# EAGLE design audio_electrode (EAGLE 5.06)
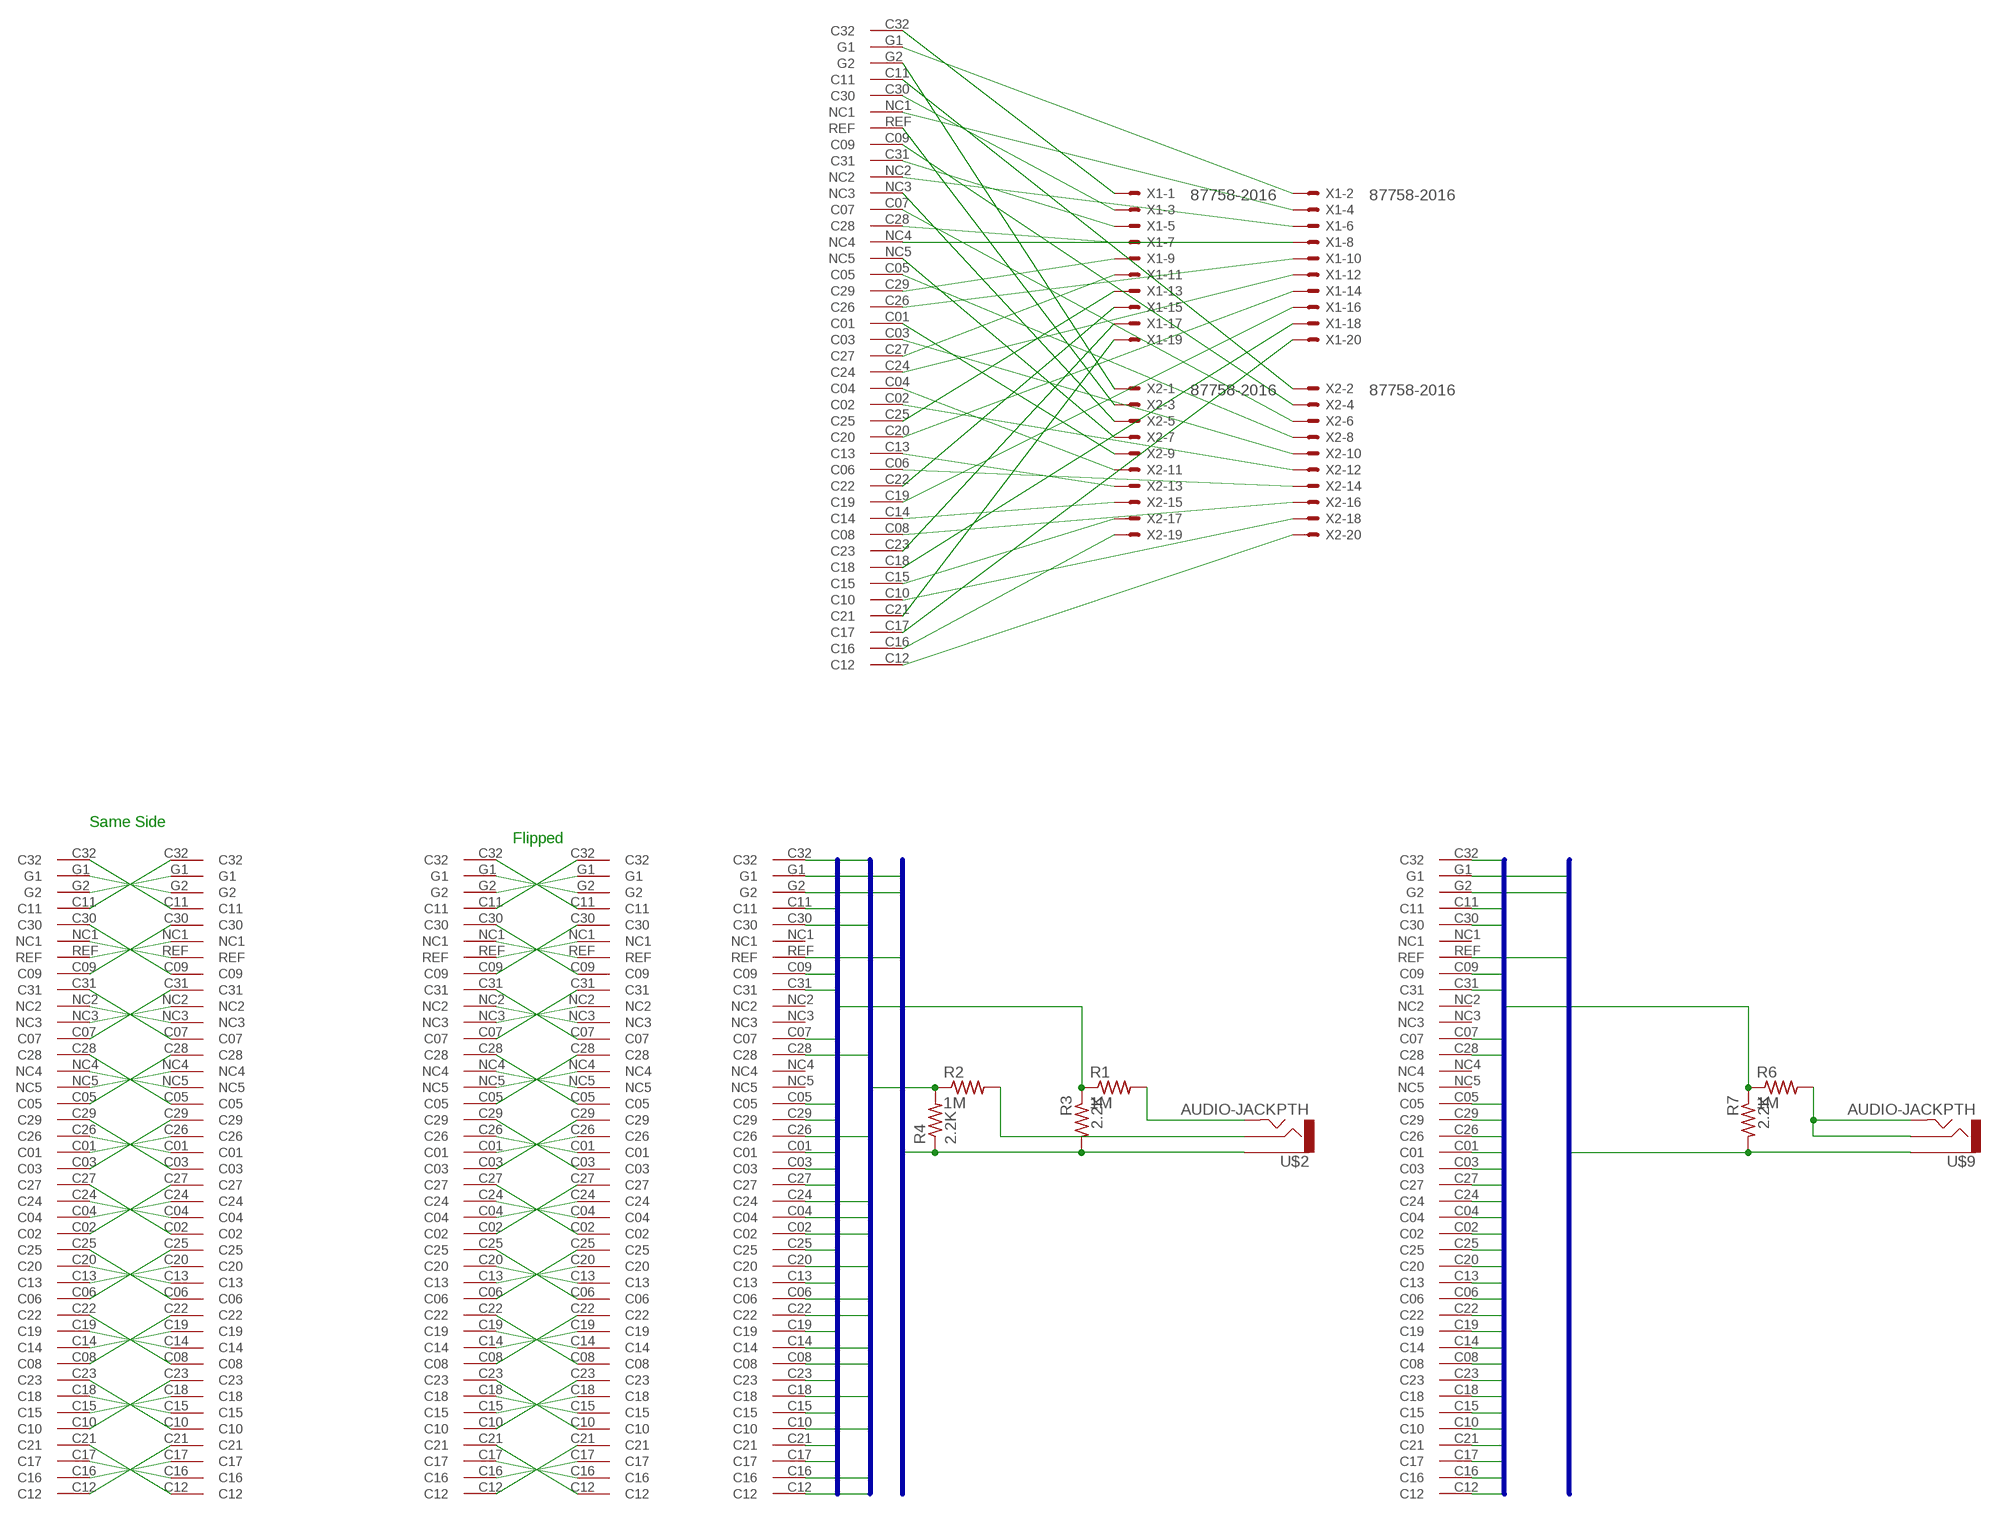
[diagram p0: schematic, sheet 1]

## Parts
R1  1M  R-US_M1206  [M1206]
R2  1M  R-US_M1206  [M1206]
R3  2.2K  R-US_0207/2V  [0207/2V]
R4  2.2K  R-US_0207/2V  [0207/2V]
R6  1M  R-US_0207/2V  [0207/2V]
R7  2.2K  R-US_0207/2V  [0207/2V]
U$1  MOLC-110-01-S-QNEURO-NEXUS  [MOLC-110-01-S-Q]
U$2  AUDIO-JACKPTH  [AUDIO-JACK]
U$3  MOLC-110-01-S-QNEURO-NEXUS  [MOLC-110-01-S-Q]
U$4  MOLC-110-01-S-QNEURO-NEXUS  [MOLC-110-01-S-Q]
U$5  MOLC-110-01-S-QNEURO-NEXUS  [MOLC-110-01-S-Q]
U$6  MOLC-110-01-S-QNEURO-NEXUS  [MOLC-110-01-S-Q]
U$7  MOLC-110-01-S-QNEURO-NEXUS  [MOLC-110-01-S-Q]
U$8  MOLC-110-01-S-QNEURO-NEXUS  [MOLC-110-01-S-Q]
U$9  AUDIO-JACKPTH  [AUDIO-JACK]
X1  87758-2016  [87758-2016]
X2  87758-2016  [87758-2016]

## Nets
BEVEN: R2.1 R4.2 U$1.C02 U$1.C04 U$1.C06 U$1.C08 U$1.C10 U$1.C12 U$1.C14 U$1.C16 U$1.C18 U$1.C20 U$1.C22 U$1.C24 U$1.C26 U$1.C28 U$1.C30 U$1.C32
BGND: R3.2 R4.1 U$1.G1 U$1.G2 U$1.REF U$2.1
BGND2: R7.2 U$8.G1 U$8.G2 U$8.REF U$9.1
BODD: R1.1 R3.1 U$1.C01 U$1.C03 U$1.C05 U$1.C07 U$1.C09 U$1.C11 U$1.C13 U$1.C15 U$1.C17 U$1.C19 U$1.C21 U$1.C23 U$1.C25 U$1.C27 U$1.C29 U$1.C31
BSIG: R6.1 R7.1 U$8.C01 U$8.C02 U$8.C03 U$8.C04 U$8.C05 U$8.C06 U$8.C07 U$8.C08 U$8.C09 U$8.C10 U$8.C11 U$8.C12 U$8.C13 U$8.C14 U$8.C15 U$8.C16 U$8.C17 U$8.C18 U$8.C19 U$8.C20 U$8.C21 U$8.C22 U$8.C23 U$8.C24 U$8.C25 U$8.C26 U$8.C27 U$8.C28 U$8.C29 U$8.C30 U$8.C31 U$8.C32
N$1: R1.2 U$2.5
N$2: R2.2 U$2.2
N$3: U$3.C32 U$4.C11
N$4: U$3.C11 U$4.C32
N$5: U$3.G1 U$4.G2
N$6: U$3.G2 U$4.G1
N$7: U$3.C30 U$4.C09
N$8: U$3.C09 U$4.C30
N$9: U$3.REF U$4.NC1
N$10: U$3.NC1 U$4.REF
N$11: U$3.C07 U$4.C31
N$12: U$3.C31 U$4.C07
N$13: U$3.NC3 U$4.NC2
N$14: U$3.NC2 U$4.NC3
N$15: U$3.C28 U$4.C05
N$16: U$3.C05 U$4.C28
N$17: U$3.NC5 U$4.NC4
N$18: U$3.NC4 U$4.NC5
N$19: U$3.C29 U$4.C03
N$20: U$3.C03 U$4.C29
N$21: U$3.C26 U$4.C01
N$22: U$3.C01 U$4.C26
N$23: U$3.C27 U$4.C02
N$24: U$3.C02 U$4.C27
N$25: U$3.C24 U$4.C04
N$26: U$3.C04 U$4.C24
N$27: U$3.C25 U$4.C06
N$28: U$3.C06 U$4.C25
N$29: U$3.C20 U$4.C13
N$30: U$3.C13 U$4.C20
N$31: U$3.C22 U$4.C08
N$32: U$3.C08 U$4.C22
N$33: U$3.C19 U$4.C14
N$34: U$3.C14 U$4.C19
N$35: U$3.C23 U$4.C10
N$36: U$3.C10 U$4.C23
N$37: U$3.C18 U$4.C15
N$38: U$3.C15 U$4.C18
N$39: U$3.C21 U$4.C12
N$40: U$3.C12 U$4.C21
N$41: U$3.C17 U$4.C16
N$42: U$3.C16 U$4.C17
N$43: U$7.C32 X1.1
N$44: U$5.C32 U$6.C11
N$45: U$5.C11 U$6.C32
N$46: U$7.G1 X1.2
N$47: U$5.G1 U$6.G2
N$48: U$5.G2 U$6.G1
N$49: U$5.C30 U$6.C09
N$50: U$5.C09 U$6.C30
N$51: U$5.REF U$6.NC1
N$52: U$5.NC1 U$6.REF
N$53: U$5.C07 U$6.C31
N$54: U$5.C31 U$6.C07
N$55: U$5.NC3 U$6.NC2
N$56: U$5.NC2 U$6.NC3
N$57: U$5.C28 U$6.C05
N$58: U$5.C05 U$6.C28
N$59: U$5.NC5 U$6.NC4
N$60: U$5.NC4 U$6.NC5
N$61: U$5.C29 U$6.C03
N$62: U$5.C03 U$6.C29
N$63: U$5.C26 U$6.C01
N$64: U$5.C01 U$6.C26
N$65: U$5.C27 U$6.C02
N$66: U$5.C02 U$6.C27
N$67: U$5.C24 U$6.C04
N$68: U$5.C04 U$6.C24
N$69: U$5.C25 U$6.C06
N$70: U$5.C06 U$6.C25
N$71: U$5.C20 U$6.C13
N$72: U$5.C13 U$6.C20
N$73: U$5.C22 U$6.C08
N$74: U$5.C08 U$6.C22
N$75: U$5.C19 U$6.C14
N$76: U$5.C14 U$6.C19
N$77: U$5.C23 U$6.C10
N$78: U$5.C10 U$6.C23
N$79: U$5.C18 U$6.C15
N$80: U$5.C15 U$6.C18
N$81: U$5.C21 U$6.C12
N$82: U$5.C12 U$6.C21
N$83: U$5.C17 U$6.C16
N$84: U$5.C16 U$6.C17
N$85: U$7.G2 X2.1
N$86: U$7.C11 X2.2
N$87: U$7.C30 X1.3
N$88: U$7.NC1 X1.4
N$89: U$7.REF X2.3
N$90: U$7.C09 X2.4
N$91: U$7.C31 X1.5
N$92: U$7.NC2 X1.6
N$93: U$7.NC3 X2.5
N$94: U$7.C07 X2.6
N$95: U$7.C28 X1.7
N$96: U$7.NC4 X1.8
N$97: U$7.NC5 X2.7
N$98: U$7.C05 X2.8
N$99: U$7.C29 X1.9
N$100: U$7.C26 X1.10
N$101: U$7.C01 X2.9
N$102: U$7.C03 X2.10
N$103: U$7.C27 X1.11
N$104: U$7.C24 X1.12
N$105: U$7.C04 X2.11
N$106: U$7.C02 X2.12
N$107: U$7.C25 X1.13
N$108: U$7.C20 X1.14
N$109: U$7.C13 X2.13
N$110: U$7.C06 X2.14
N$111: U$7.C22 X1.15
N$112: U$7.C19 X1.16
N$113: U$7.C14 X2.15
N$114: U$7.C08 X2.16
N$115: U$7.C23 X1.17
N$116: U$7.C18 X1.18
N$117: U$7.C15 X2.17
N$118: U$7.C10 X2.18
N$119: U$7.C21 X1.19
N$120: U$7.C17 X1.20
N$121: U$7.C16 X2.19
N$122: U$7.C12 X2.20
N$127: R6.2 U$9.2 U$9.5
Unconnected: U$1.NC1 U$1.NC2 U$1.NC3 U$1.NC4 U$1.NC5 U$8.NC1 U$8.NC2 U$8.NC3 U$8.NC4 U$8.NC5

## Buses
BODD
BEVEN
BGND
BSIG
BGND2

## Notes on the sheet
- Same Side
- Flipped

## Library data of the parts
R1-R4 R6 R7 = resistor:R-US_: RESISTOR, American symbol
U$1 U$3-U$8 = coxlab:MOLC-110-01-S-Q
U$2 U$9 = SparkFun:AUDIO-JACK: 3.5mm Audio Jack Simple 3.5mm common PCB mount audio jack. SKU: PRT-08032
X1 X2 = con-molex:87758-2016: 20 Pin - 2mm Dual Row Single Wafer, Vertical T/H HDR Source: http://www.molex.com/pdm_docs/sd/877580616_sd.pdf

## Board
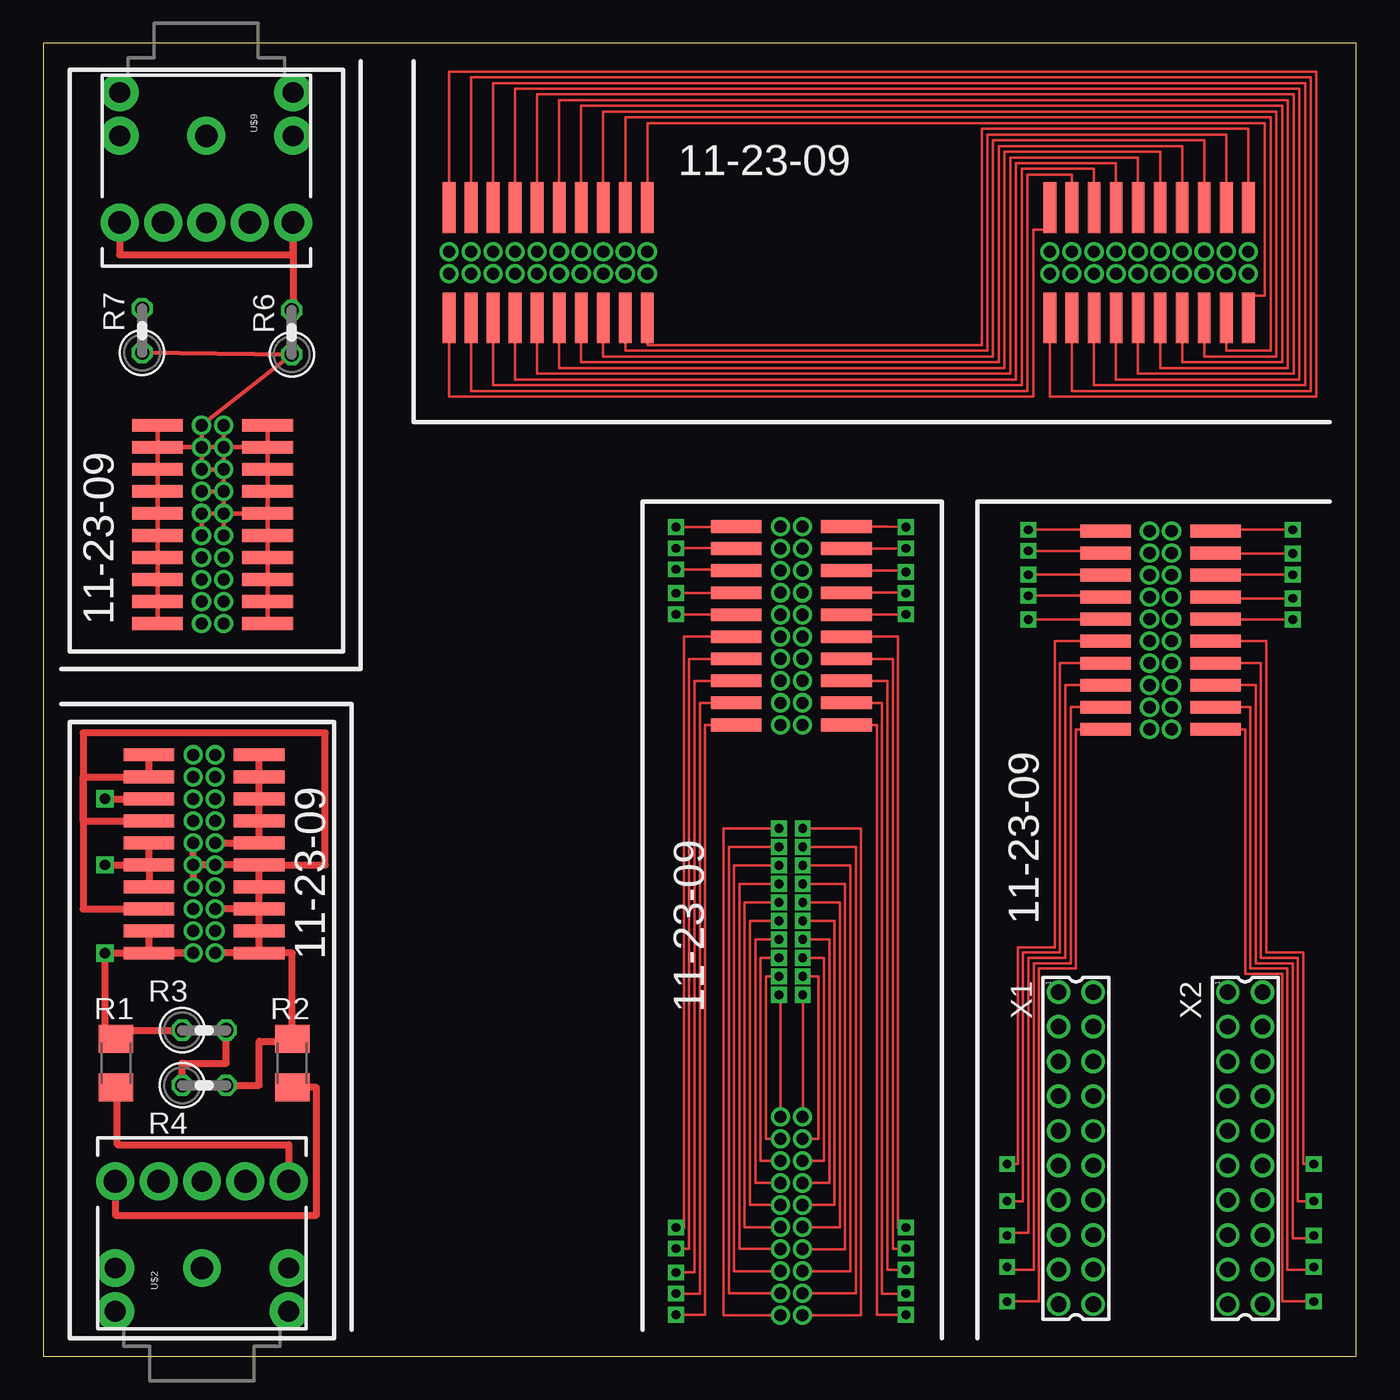
[diagram p1: board, top side]
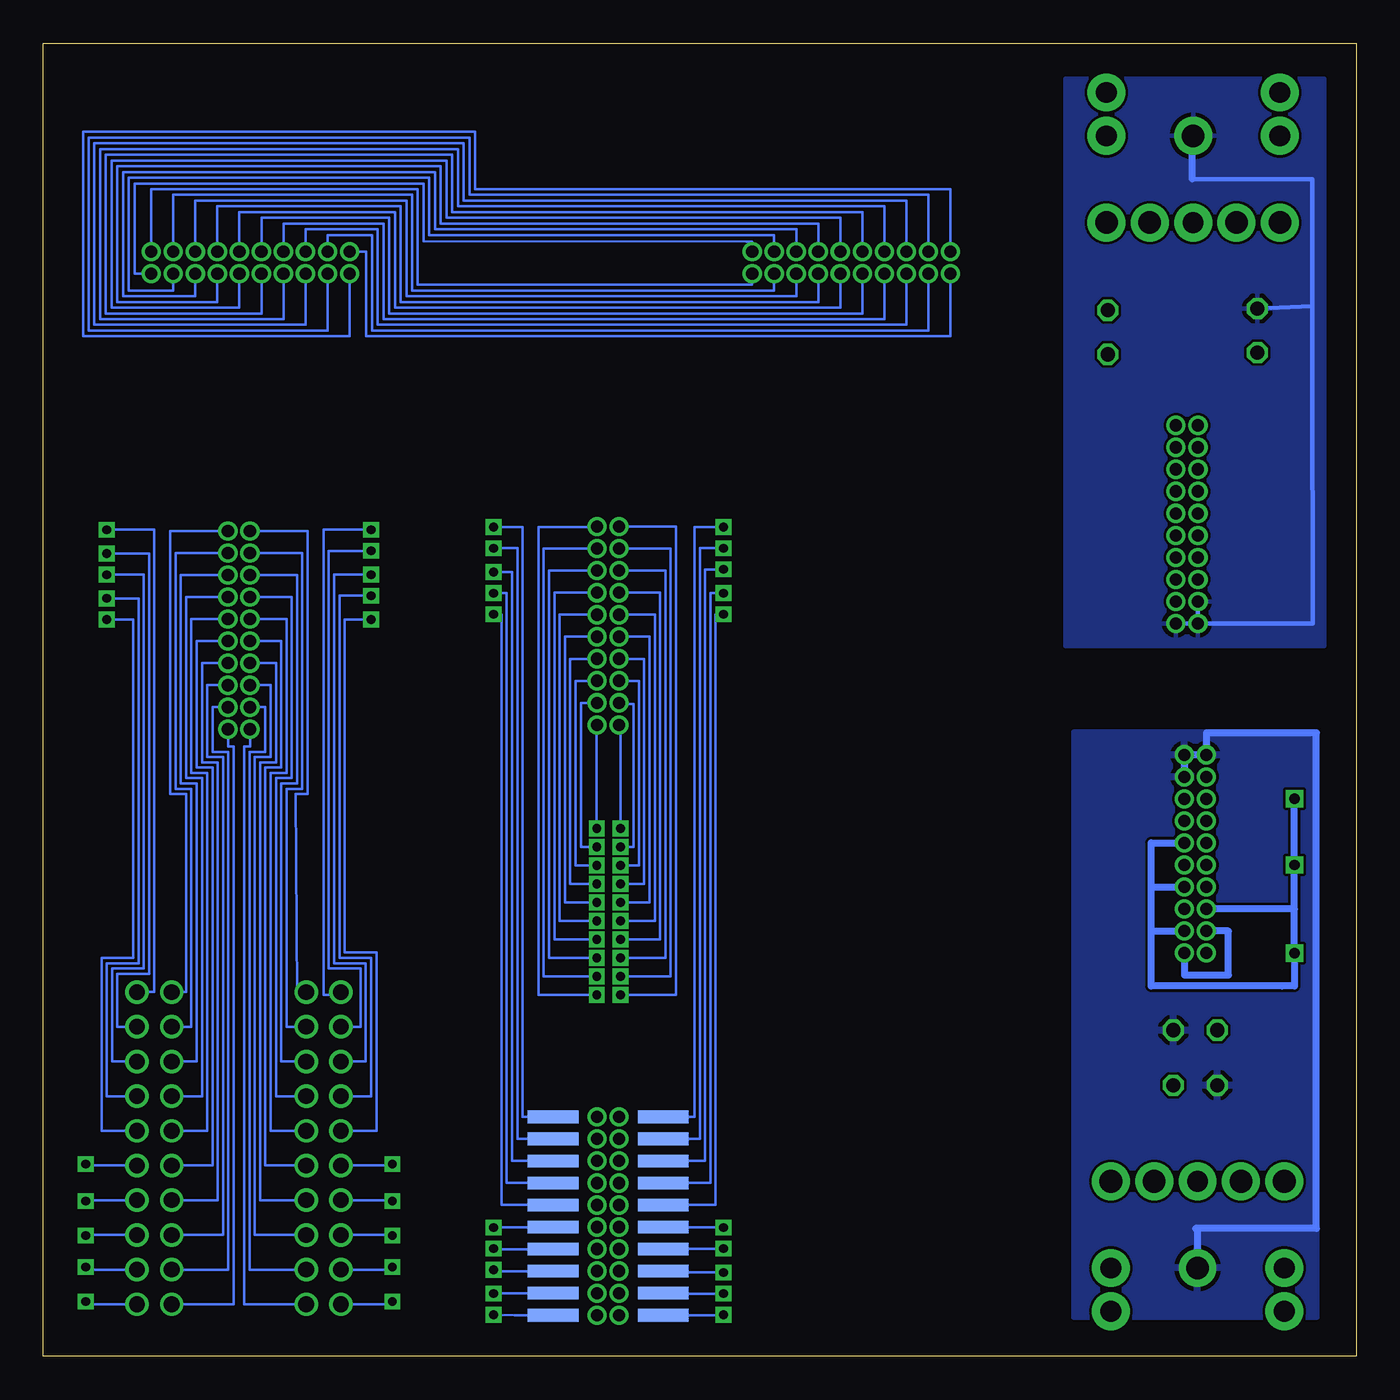
[diagram p2: board, bottom side, seen from below]

Size 75.69 x 75.69 mm. Coordinates in mm from the lower left corner, seen from the top.
Outline: 0,0 75.69,0 75.69,75.69 0,75.69 0,0
Copper layers (1*16): Top 0.0178mm / dielectric 1.4986mm / Bottom 0.0178mm
Design rules "SSC-EAGLE-2Lyr_v1.0.0.3": minimum track width 6mil, minimum drill 14mil, track to track 6mil, track to pad 6mil, pad to pad 6mil, via to via 6mil, smd to smd 6mil, copper to edge 20mil, drill to drill 16mil, minimum pad ring 8mil, minimum via ring 8mil, stop-mask expansion 3mil, vias tented up to drill 0mil, thermal gap 10mil

### Footprints (pad centres in the part's own frame; a part is rotated, then mirrored left to right if it is on the bottom)
M1206 = smd 1.6 x 2: 1 -1.4,0; 2 1.4,0
0207/2V = drill 0.813 octagon: 1 -1.27,0; 2 1.27,0
MOLC-110-01-S-Q = drill 0.7 pad 1.067 round: C01 0.635,0.635; C04 0.635,-0.635; C13 0.635,-1.905; C14 0.635,-3.175; C15 0.635,-4.445; C16 0.635,-5.715; C17 -0.635,-5.715; C18 -0.635,-4.445; C19 -0.635,-3.175; C20 -0.635,-1.905; C24 -0.635,-0.635; C26 -0.635,0.635; G1 -0.635,5.715; G2 0.635,5.715; NC1 -0.635,4.445; NC2 -0.635,3.175; NC3 0.635,3.175; NC4 -0.635,1.905; NC5 0.635,1.905; REF 0.635,4.445 | smd 2.921 x 0.737: C02 3.175,-0.635; C03 3.175,0.635; C05 3.175,1.905; C06 3.175,-1.905; C07 3.175,3.175; C08 3.175,-3.175; C09 3.175,4.445; C10 3.175,-4.445; C11 3.175,5.715; C12 3.175,-5.715; C21 -3.175,-5.715; C22 -3.175,-3.175; C23 -3.175,-4.445; C25 -3.175,-1.905; C27 -3.175,-0.635; C28 -3.175,1.905; C29 -3.175,0.635; C30 -3.175,4.445; C31 -3.175,3.175; C32 -3.175,5.715
AUDIO-JACK = drill 1.3 pad 2.184 round: 1 0,0; 2 5,5; 3 5,2.5; 4 5,-2.5; 5 5,-5 | drill 1.2 pad 2.184 round: 6 0,5; 7 -2.5,5; 8 5,0; 9 -2.5,-5; 10 0,-5
87758-2016 = drill 0.9 pad 1.27 round: 1 -9,-1; 2 -9,1; 3 -7,-1; 4 -7,1; 5 -5,-1; 6 -5,1; 7 -3,-1; 8 -3,1; 9 -1,-1; 10 -1,1; 11 1,-1; 12 1,1; 13 3,-1; 14 3,1; 15 5,-1; 16 5,1; 17 7,-1; 18 7,1; 19 9,-1; 20 9,1

### Placement (x,y rotation side)
R1  4.19,16.89 270 top
R2  14.35,16.89 270 top
R3  9.27,18.8 0 top
R4  9.27,15.62 0 top
R6  14.33,59.03 90 top
R7  5.69,59.13 90 top
U$1  9.27,28.96 0 top
U$2  9.14,5.08 90 top
U$3  63.75,63.04 90 top
U$4  29.11,63.04 90 top
U$5  43.13,42.11 0 top
U$6  43.13,8.08 0 bottom
U$7  64.41,41.86 0 top
U$8  9.75,47.96 180 top
U$9  9.4,70.36 270 top
X1  59.54,11.99 270 top
X2  69.29,11.99 270 top

### Tracks (layer width: path | path; a pad name or v marks a point on that pad's centre or on a via)
BEVEN
  Top 0.406: U$1.C32 U$1.C30 2.29,33.4 2.29,30.86 | U$1.C02 U$1.C06 U$1.C08 | U$1.C08 U$1.C10 U$1.C12 | U$1.C12 U$1.C16 | U$1.C08 U$1.C14 | U$1.C02 U$1.C04 U$1.C24 | U$1.C24 U$1.C26 | U$1.C24 U$1.C20 | U$1.C22 2.29,25.78 2.29,30.86 | 2.29,30.86 U$1.C28 | 2.29,30.86 2.29,35.94 16.26,35.94 16.26,28.32 U$1.C02 | U$1.C12 14.35,23.24 R2.1 14.35,18.16 12.45,18.16 12.45,15.62 R4.2
  Bottom 0.406: U$1.C18 7.37,24.51 7.37,21.97 9.91,21.97 U$1.C16
BGND
  Top 0.406: R3.2 10.54,16.89 8,16.89 R4.1
  Bottom 0.406: U$1.G2 U$1.G1 8.64,35.94 2.29,35.94 2.29,7.37 9.14,7.37 | U$1.G2 U$1.REF U$1.G2 | 9.14,7.37 9.27,7.37 | 9.14,7.37 U$2.1
  pour Bottom: 16.26,2.29 2.29,2.29 2.29,35.94 16.26,35.94
BGND2
  Bottom 0.254: U$8.G2 U$8.G1 | U$8.G2 U$8.REF | U$8.G2 2.49,42.24 2.54,57.61 2.54,60.55 | 2.54,60.55 2.54,67.87 9.45,67.87 | 2.54,60.55 R7.2
  Bottom 0.406: U$9.1 9.45,70.36 9.45,67.87
  pour Bottom: 1.83,73.66 16.76,73.66 16.76,40.94 1.83,40.94
BODD  (via drill 0.6)
  Top 0.406: U$1.C11 U$1.C09 U$1.C07 U$1.C05 U$1.C03 U$1.C01 | U$1.C27 U$1.C29 | U$1.C27 U$1.C25 | U$1.C23 U$1.C21 U$1.C17 v3.56,23.24 3.56,18.29 R1.1 4.19,18.8 R3.1 | v3.56,32.13 U$1.C31 | v3.56,28.32 U$1.C27
  Bottom 0.406: 11.81,24.51 U$1.C15 | 11.81,24.51 11.81,21.34 3.56,21.34 | 3.56,25.78 U$1.C19 | 3.56,25.78 v3.56,28.32 v3.56,32.13 | 11.81,27.05 11.81,29.59 U$1.C01 | 11.81,27.05 U$1.C13 | 11.81,24.51 11.81,27.05 | 3.56,25.78 v3.56,23.24 3.56,21.34 | 3.56,21.34 4.27,21.34
BSIG
  Top 0.254: U$8.C17 U$8.C18 U$8.C19 | U$8.C10 U$8.C12 | U$8.C10 U$8.C08 U$8.C06 U$8.C02 U$8.C03 U$8.C05 U$8.C07 U$8.C09 U$8.C11 | U$8.C32 U$8.C30 U$8.C31 U$8.C28 U$8.C29 U$8.C27 | U$8.C27 U$8.C25 U$8.C22 U$8.C23 | U$8.C23 U$8.C21 12.8,53.67 | U$8.C10 U$8.C23 | U$8.C19 U$8.C14 U$8.C15 U$8.C16 R6.1 R7.1 | U$8.C20 U$8.C19 | U$8.C20 U$8.C13 | U$8.C24 U$8.C20 | U$8.C24 U$8.C26 | U$8.C27 U$8.C24 | U$8.C24 U$8.C04 U$8.C01
N$1
  Top 0.406: R1.2 4.27,15.49 4.27,12.19 14.14,12.19 U$2.5
N$2
  Top 0.406: 14.27,15.49 R2.2 15.75,15.49 15.75,8.13 4.14,8.13 U$2.2
N$3
  Top 0.152: U$3.C32 58.04,55.32 73.41,55.32 73.41,74.07 23.39,74.07 U$4.C11
N$4
  Top 0.152: U$3.C11 58.04,64.95 57.07,64.95 57.07,55.32 23.39,55.32 U$4.C32
N$5
  Bottom 0.152: U$3.G1 58.04,58.8 73.41,58.8 73.41,70.59 50.8,70.59 50.8,67.28 23.39,67.28 U$4.G2
N$6
  Bottom 0.152: U$3.G2 57.07,63.68 57.07,58.8 23.39,58.8 U$4.G1
N$7
  Top 0.152: U$4.C09 24.66,73.74 73.08,73.74 73.08,55.65 59.31,55.65 U$3.C30
N$8
  Top 0.152: U$3.C09 59.31,68.12 56.74,68.12 56.74,55.65 24.66,55.65 U$4.C30
N$9
  Bottom 0.152: U$4.NC1 24.66,59.13 56.74,59.13 56.74,64.64 59.31,64.64 U$3.REF
N$10
  Bottom 0.152: U$4.REF 24.66,66.95 51.13,66.95 51.13,70.26 73.08,70.26 73.08,59.13 59.31,59.13 U$3.NC1
N$11
  Top 0.152: U$4.C31 25.93,55.98 56.41,55.98 56.41,68.45 60.58,68.45 U$3.C07
N$12
  Top 0.152: U$3.C31 60.58,55.98 72.75,55.98 72.75,73.41 25.93,73.41 U$4.C07
N$13
  Bottom 0.152: U$3.NC3 60.58,64.97 56.41,64.97 56.41,59.46 25.93,59.46 U$4.NC2
N$14
  Bottom 0.152: U$3.NC2 60.58,59.46 72.75,59.46 72.75,69.93 51.46,69.93 51.46,66.62 25.93,66.62 U$4.NC3
N$15
  Top 0.152: U$4.C05 27.2,73.08 72.42,73.08 72.42,56.31 61.85,56.31 U$3.C28
N$16
  Top 0.152: U$3.C05 61.85,68.78 56.08,68.78 56.08,56.31 27.2,56.31 U$4.C28
N$17
  Bottom 0.152: U$4.NC4 27.2,59.79 56.08,59.79 56.08,65.3 61.85,65.3 U$3.NC5
N$18
  Bottom 0.152: U$4.NC5 27.2,66.29 51.79,66.29 51.79,69.6 72.42,69.6 72.42,59.79 61.85,59.79 U$3.NC4
N$19
  Top 0.152: U$3.C29 63.12,56.64 72.08,56.64 72.08,72.75 28.47,72.75 U$4.C03
N$20
  Top 0.152: U$4.C29 28.47,56.64 55.75,56.64 55.75,69.11 63.12,69.11 U$3.C03
N$21
  Bottom 0.152: U$3.C26 63.12,60.12 72.08,60.12 72.08,69.27 52.12,69.27 52.12,65.96 28.47,65.96 U$4.C01
N$22
  Bottom 0.152: U$3.C01 63.12,65.63 55.75,65.63 55.75,60.12 28.47,60.12 U$4.C26
N$23
  Top 0.152: U$4.C02 29.74,72.42 71.75,72.42 71.75,56.97 64.39,56.97 U$3.C27
N$24
  Top 0.152: U$3.C02 64.39,69.44 55.42,69.44 55.42,56.97 29.74,56.97 U$4.C27
N$25
  Bottom 0.152: U$4.C04 29.74,65.63 52.45,65.63 52.45,68.94 71.75,68.94 71.75,60.45 64.39,60.45 U$3.C24
N$26
  Bottom 0.152: U$4.C24 29.74,60.45 55.42,60.45 55.42,65.96 64.39,65.96 U$3.C04
N$27
  Top 0.152: U$3.C25 65.66,57.3 71.42,57.3 71.42,72.08 31.01,72.08 U$4.C06
N$28
  Top 0.152: U$4.C25 31.01,57.3 55.09,57.3 55.09,69.77 65.66,69.77 U$3.C06
N$29
  Bottom 0.152: U$3.C20 65.66,60.78 71.42,60.78 71.42,68.61 52.78,68.61 52.78,65.3 31.01,65.3 U$4.C13
N$30
  Bottom 0.152: U$3.C13 65.66,66.29 55.09,66.29 55.09,60.78 31.01,60.78 U$4.C20
N$31
  Top 0.152: U$4.C08 32.28,71.75 71.09,71.75 71.09,57.63 66.93,57.63 U$3.C22
N$32
  Top 0.152: U$3.C08 66.93,70.1 54.76,70.1 54.76,57.63 32.28,57.63 U$4.C22
N$33
  Bottom 0.152: U$4.C14 32.28,64.97 53.11,64.97 53.11,68.28 71.09,68.28 71.09,61.11 66.93,61.11 U$3.C19
N$34
  Bottom 0.152: U$4.C19 32.28,61.11 54.76,61.11 54.76,66.62 66.93,66.62 U$3.C14
N$35
  Top 0.152: U$3.C23 68.2,57.96 70.76,57.96 70.76,71.42 33.55,71.42 U$4.C10
N$36
  Top 0.152: U$4.C23 33.55,57.96 54.43,57.96 54.43,70.43 68.2,70.43 U$3.C10
N$37
  Bottom 0.152: U$3.C18 68.2,61.44 70.76,61.44 70.76,67.94 53.44,67.94 53.44,64.64 33.55,64.64 U$4.C15
N$38
  Bottom 0.152: U$3.C15 68.2,66.95 54.43,66.95 54.43,61.44 33.55,61.44 U$4.C18
N$39
  Top 0.152: U$3.C21 69.47,61.14 70.43,61.14 70.43,71.09 34.82,71.09 U$4.C12
N$40
  Top 0.152: U$3.C12 69.47,70.76 54.1,70.76 54.1,58.29 34.82,58.29 U$4.C21
N$41
  Bottom 0.152: U$3.C17 70.43,62.41 70.43,67.61 53.77,67.61 53.77,64.29 35.15,64.26 34.82,64.26 U$4.C16
N$42
  Bottom 0.152: U$4.C17 34.82,61.77 54.1,61.77 54.1,67.28 69.47,67.28 U$3.C16
N$43  (via drill 0.5)
  Top 0.152: U$7.C32 61.24,47.65 v56.79,47.65
  Bottom 0.152: v56.79,47.65 59.54,47.65 59.54,20.83 58.54,20.83 X1.1
N$44  (via drill 0.5)
  Top 0.152: U$5.C32 39.95,47.8 v36.47,47.8
  Bottom 0.152: 39.95,13.82 U$6.C11 38.15,13.79 38.15,47.8 v36.47,47.8
N$45  (via drill 0.5)
  Top 0.152: U$5.C11 48.67,47.83 v49.73,47.8
  Bottom 0.152: 46.3,13.66 U$6.C32 48.06,13.79 48.06,47.8 v49.73,47.8
N$46
  Bottom 0.152: U$7.G1 60.45,47.57 60.45,32.41 61.15,32.41 61.06,20.83 60.54,20.83 X1.2
N$47  (via drill 0.5)
  Top 0.152: U$6.G2 42.49,20.83 v42.42,20.83
  Bottom 0.152: 42.57,20.83 v42.42,20.83 39.22,20.83 39.22,47.83 U$5.G1
N$48  (via drill 0.5)
  Top 0.152: U$6.G1 43.79,13.79 v43.79,20.83
  Bottom 0.152: v43.79,20.83 47.14,20.83 47.14,47.8 43.76,47.8 U$5.G2
N$49  (via drill 0.5)
  Top 0.152: U$5.C30 39.95,46.58 v36.47,46.58
  Bottom 0.152: 39.95,12.45 U$6.C09 37.85,12.52 37.85,46.58 v36.47,46.58
N$50  (via drill 0.5)
  Top 0.152: U$5.C09 49.12,46.56 v49.73,46.58
  Bottom 0.152: 46.3,12.45 U$6.C30 48.36,12.52 48.36,46.58 v49.73,46.58
N$51  (via drill 0.5)
  Top 0.152: U$6.NC1 44.7,12.52 44.7,21.89 v43.79,21.89
  Bottom 0.152: v43.79,21.89 46.84,21.89 46.84,46.56 U$5.REF
N$52  (via drill 0.5)
  Top 0.152: U$6.REF 41.66,12.52 41.66,21.89 v42.42,21.89
  Bottom 0.152: v42.42,21.89 39.52,21.89 39.52,46.56 U$5.NC1
N$53  (via drill 0.5)
  Top 0.152: U$5.C07 49.73,45.29 v49.73,45.21
  Bottom 0.152: 46.3,11.23 U$6.C31 48.67,11.25 48.67,45.21 v49.73,45.21
N$54  (via drill 0.5)
  Top 0.152: U$5.C31 39.95,45.36 v36.47,45.36
  Bottom 0.152: 39.95,11.23 U$6.C07 37.54,11.25 37.54,45.36 v36.47,45.36
N$55  (via drill 0.5)
  Top 0.152: U$6.NC2 45.01,11.25 45.01,22.96 v43.79,22.96
  Bottom 0.152: v43.79,22.96 46.53,22.96 46.53,45.29 U$5.NC3
N$56  (via drill 0.5)
  Top 0.152: U$6.NC3 41.35,11.25 41.35,22.96 v42.42,22.96
  Bottom 0.152: v42.42,22.96 39.83,22.96 39.83,45.29 U$5.NC2
N$57  (via drill 0.5)
  Top 0.152: U$5.C28 39.95,43.99 v36.47,43.99
  Bottom 0.152: 39.95,10.01 U$6.C05 37.24,9.98 37.24,43.99 v36.47,43.99
N$58  (via drill 0.5)
  Top 0.152: U$5.C05 49.73,44.02 v49.73,43.99
  Bottom 0.152: 46.3,10.01 U$6.C28 48.97,9.98 48.97,43.99 v49.73,43.99
N$59  (via drill 0.5)
  Top 0.152: U$6.NC4 45.31,9.98 45.31,24.03 v43.79,24.03
  Bottom 0.152: v43.79,24.03 46.23,24.03 46.23,44.02 U$5.NC5
N$60  (via drill 0.5)
  Top 0.152: U$6.NC5 41.05,9.98 41.05,24.03 v42.42,24.03
  Bottom 0.152: v42.42,24.03 40.13,24.03 40.13,44.02 U$5.NC4
N$61  (via drill 0.5)
  Top 0.152: U$5.C29 39.95,42.77 v36.47,42.77
  Bottom 0.152: 39.95,8.79 U$6.C03 36.93,8.71 36.93,42.77 v36.47,42.77
N$62  (via drill 0.5)
  Top 0.152: U$5.C03 49.58,42.75 v49.73,42.77
  Bottom 0.152: 46.3,8.79 U$6.C29 49.28,8.71 49.28,42.77 v49.73,42.77
N$63  (via drill 0.5)
  Top 0.152: U$6.C01 40.74,8.71 40.74,25.09 v42.42,25.09
  Bottom 0.152: v42.42,25.09 40.44,25.09 40.44,42.75 U$5.C26
N$64  (via drill 0.5)
  Top 0.152: U$6.C26 45.62,8.71 45.62,25.09 v43.79,25.09
  Bottom 0.152: v43.79,25.09 45.92,25.09 45.92,42.75 U$5.C01
N$65  (via drill 0.5)
  Top 0.152: 39.95,41.55 U$5.C27 36.93,41.48 36.93,7.42 v36.47,7.42
  Bottom 0.152: U$6.C02 39.95,7.42 v36.47,7.42
N$66  (via drill 0.5)
  Top 0.152: 46.3,41.55 U$5.C02 49.28,41.48 49.28,7.42 v49.73,7.42
  Bottom 0.152: v49.73,7.42 46.3,7.42 U$6.C27
N$67  (via drill 0.5)
  Top 0.152: U$6.C04 40.44,7.44 40.44,26.16 v42.42,26.16
  Bottom 0.152: v42.42,26.16 40.74,26.16 40.74,41.48 U$5.C24
N$68  (via drill 0.5)
  Top 0.152: U$6.C24 45.92,7.44 45.92,26.16 v43.79,26.16
  Bottom 0.152: v43.79,26.16 45.62,26.16 45.62,41.48 U$5.C04
N$69  (via drill 0.5)
  Top 0.152: 39.95,40.18 U$5.C25 37.24,40.21 37.24,6.2 v36.47,6.2
  Bottom 0.152: U$6.C06 39.95,6.2 v36.47,6.2
N$70  (via drill 0.5)
  Top 0.152: 46.3,40.18 U$5.C06 48.97,40.21 48.97,6.2 v49.73,6.2
  Bottom 0.152: v49.73,6.2 50.04,6.17 U$6.C25
N$71  (via drill 0.5)
  Top 0.152: U$6.C13 42.49,6.2 40.13,6.2 40.13,27.23 v42.42,27.23
  Bottom 0.152: v42.42,27.23 41.05,27.23 41.05,40.21 U$5.C20
N$72  (via drill 0.5)
  Top 0.152: U$6.C20 46.23,6.17 46.23,27.23 v43.79,27.23
  Bottom 0.152: v43.79,27.23 45.31,27.23 45.31,40.21 U$5.C13
N$73  (via drill 0.5)
  Top 0.152: 39.95,38.96 U$5.C22 37.54,38.94 37.54,4.83 v36.47,4.83
  Bottom 0.152: U$6.C08 39.95,4.83 v36.47,4.83
N$74  (via drill 0.5)
  Top 0.152: 46.3,38.96 U$5.C08 48.67,38.94 48.67,4.98 v49.73,4.98
  Bottom 0.152: v49.73,4.98 50.04,4.9 U$6.C22
N$75  (via drill 0.5)
  Top 0.152: U$6.C14 39.83,4.9 39.83,28.3 v42.42,28.3
  Bottom 0.152: v42.42,28.3 41.35,28.3 41.35,38.94 U$5.C19
N$76  (via drill 0.5)
  Top 0.152: U$6.C19 46.53,4.9 46.53,28.3 v43.79,28.3
  Bottom 0.152: v43.79,28.3 45.01,28.3 45.01,38.94 U$5.C14
N$77  (via drill 0.5)
  Top 0.152: 39.95,37.59 U$5.C23 37.85,37.67 37.85,3.61 v36.47,3.61
  Bottom 0.152: U$6.C10 39.95,3.61 v36.47,3.61
N$78  (via drill 0.5)
  Top 0.152: 46.3,37.59 U$5.C10 48.36,37.67 48.36,3.61 v49.73,3.61
  Bottom 0.152: v49.73,3.61 50.04,3.63 U$6.C23
N$79  (via drill 0.5)
  Top 0.152: U$6.C15 39.52,3.63 39.52,29.36 v42.42,29.36
  Bottom 0.152: v42.42,29.36 41.66,29.36 41.66,37.59 42.49,37.59 U$5.C18
N$80  (via drill 0.5)
  Top 0.152: U$6.C18 46.84,3.63 46.84,29.36 v43.79,29.36
  Bottom 0.152: v43.79,29.36 44.7,29.36 44.7,37.67 U$5.C15
N$81  (via drill 0.5)
  Top 0.152: 39.95,36.52 U$5.C21 38.15,36.4 38.15,2.39 v36.47,2.39
  Bottom 0.152: v36.47,2.39 36.47,2.36 U$6.C12
N$82  (via drill 0.5)
  Top 0.152: 46.3,36.37 U$5.C12 48.06,36.4 48.06,2.39 v49.73,2.39
  Bottom 0.152: U$6.C21 48.51,2.36 v49.73,2.39
N$83  (via drill 0.5)
  Top 0.152: v42.42,30.43 39.22,30.43 39.22,2.36 U$6.C16
  Bottom 0.152: v42.42,30.43 42.42,36.4 U$5.C17
N$84  (via drill 0.5)
  Top 0.152: U$6.C17 47.14,2.36 47.14,30.43 v43.79,30.43
  Bottom 0.152: v43.79,30.43 43.79,36.4 U$5.C16
N$85
  Bottom 0.152: U$7.G2 68.38,47.57 68.38,32.41 67.46,32.41 67.46,20.99 X2.1
N$86  (via drill 0.5)
  Top 0.152: U$7.C11 67.59,47.65 v72.03,47.65
  Bottom 0.152: v72.03,47.65 69.29,47.65 69.29,20.99 X2.2
N$87  (via drill 0.5)
  Top 0.152: U$7.C30 61.24,46.43 v56.79,46.43
  Bottom 0.152: v56.79,46.43 59.23,46.43 59.23,22.35 57.4,22.35 57.4,18.99 X1.3
N$88
  Bottom 0.152: U$7.NC1 60.76,46.3 60.76,32.72 61.67,32.72 61.67,18.99 X1.4
N$89
  Bottom 0.152: U$7.REF 68.07,46.3 68.07,32.72 67.16,32.72 67.16,18.99 X2.3
N$90  (via drill 0.5)
  Top 0.152: U$7.C09 67.59,46.28 v72.03,46.28
  Bottom 0.152: v72.03,46.28 69.6,46.28 69.6,22.05 71.42,22.05 71.42,18.99 X2.4
N$91  (via drill 0.5)
  Top 0.152: U$7.C31 61.24,45.06 v56.79,45.06
  Bottom 0.152: v56.79,45.06 58.93,45.06 58.93,22.66 57.1,22.66 57.1,16.99 X1.5
N$92
  Bottom 0.152: U$7.NC2 61.06,45.03 61.06,33.02 61.98,33.02 61.98,16.99 X1.6
N$93
  Bottom 0.152: U$7.NC3 67.77,45.03 67.77,33.02 66.85,33.02 66.85,16.99 X2.5
N$94  (via drill 0.5)
  Top 0.152: U$7.C07 67.59,45.06 v72.03,45.06
  Bottom 0.152: v72.03,45.06 69.9,45.06 69.9,22.35 71.73,22.35 71.73,16.99 X2.6
N$95  (via drill 0.5)
  Top 0.152: U$7.C28 61.24,43.84 v56.79,43.84
  Bottom 0.152: v56.79,43.84 58.62,43.84 58.62,22.96 56.79,22.96 56.79,14.99 X1.7
N$96
  Bottom 0.152: U$7.NC4 61.37,43.76 61.37,33.33 62.28,33.33 62.28,14.99 X1.8
N$97
  Bottom 0.152: U$7.NC5 67.46,43.76 67.46,33.33 66.55,33.33 66.55,14.99 X2.7
N$98  (via drill 0.5)
  Top 0.152: U$7.C05 67.59,43.69 v72.03,43.69
  Bottom 0.152: v72.03,43.69 70.21,43.69 70.21,22.66 72.03,22.66 72.03,14.99 X2.8
N$99  (via drill 0.5)
  Top 0.152: U$7.C29 61.24,42.47 v56.79,42.47
  Bottom 0.152: v56.79,42.47 58.32,42.47 58.32,23.27 56.49,23.27 56.49,12.99 X1.9
N$100
  Bottom 0.152: U$7.C26 61.67,42.49 61.67,33.63 62.59,33.63 62.59,12.99 X1.10
N$101
  Bottom 0.152: U$7.C01 67.16,42.49 67.16,33.63 66.24,33.63 66.24,12.99 X2.9
N$102  (via drill 0.5)
  Top 0.152: U$7.C03 67.59,42.47 v72.03,42.47
  Bottom 0.152: v72.03,42.47 70.51,42.47 70.51,22.96 72.34,22.96 72.34,12.99 X2.10
N$103  (via drill 0.5)
  Top 0.152: U$7.C27 58.32,41.22 58.32,23.57 56.19,23.57 56.19,11.07 v55.58,11.07
  Bottom 0.152: X1.11 55.58,10.99 v55.58,11.07
N$104
  Bottom 0.152: U$7.C24 61.98,41.22 61.98,33.93 62.89,33.93 62.89,10.99 X1.12
N$105
  Bottom 0.152: U$7.C04 66.85,41.22 66.85,33.93 65.94,33.93 65.94,10.99 X2.11
N$106  (via drill 0.5)
  Top 0.152: U$7.C02 70.51,41.22 70.51,23.27 72.64,23.27 72.64,11.07 v73.25,11.07
  Bottom 0.152: X2.12 73.25,10.99 v73.25,11.07
N$107  (via drill 0.5)
  Top 0.152: U$7.C25 58.62,39.95 58.62,23.27 56.49,23.27 56.49,8.94 v55.58,8.94
  Bottom 0.152: X1.13 55.58,8.99 v55.58,8.94
N$108
  Bottom 0.152: U$7.C20 62.28,39.95 62.28,34.24 63.2,34.24 63.2,8.99 X1.14
N$109
  Bottom 0.152: U$7.C13 66.55,39.95 66.55,34.24 65.63,34.24 65.63,8.99 X2.13
N$110  (via drill 0.5)
  Top 0.152: U$7.C06 70.21,39.95 70.21,22.96 72.34,22.96 72.34,8.94 v73.25,8.94
  Bottom 0.152: X2.14 73.25,8.99 v73.25,8.94
N$111  (via drill 0.5)
  Top 0.152: U$7.C22 58.93,38.68 58.93,22.96 56.79,22.96 56.79,7.11 55.58,7.11 v55.58,6.96
  Bottom 0.152: X1.15 55.58,6.99 v55.58,6.96
N$112
  Bottom 0.152: U$7.C19 62.59,38.68 62.59,34.54 63.5,34.54 63.5,6.99 X1.16
N$113
  Bottom 0.152: U$7.C14 66.24,38.68 66.24,34.54 65.33,34.54 65.33,6.99 X2.15
N$114  (via drill 0.5)
  Top 0.152: U$7.C08 69.9,38.68 69.9,22.66 72.03,22.66 72.03,6.81 73.25,6.81 v73.25,6.96
  Bottom 0.152: X2.16 73.25,6.99 v73.25,6.96
N$115  (via drill 0.5)
  Top 0.152: U$7.C23 59.23,37.41 59.23,22.66 57.1,22.66 57.1,4.98 55.58,4.98 v55.58,5.13
  Bottom 0.152: X1.17 55.58,4.99 v55.58,5.13
N$116
  Bottom 0.152: U$7.C18 62.89,37.41 62.89,34.85 63.8,34.85 63.8,4.99 X1.18
N$117
  Bottom 0.152: U$7.C15 65.94,37.41 65.94,34.85 65.02,34.85 65.02,4.99 X2.17
N$118  (via drill 0.5)
  Top 0.152: U$7.C10 69.6,37.41 69.6,22.35 71.73,22.35 71.73,4.98 73.25,4.98 v73.25,5.13
  Bottom 0.152: X2.18 73.25,4.99 v73.25,5.13
N$119  (via drill 0.5)
  Top 0.152: U$7.C21 59.54,36.14 59.54,22.35 57.4,22.35 57.4,3.15 v55.58,3.15
  Bottom 0.152: X1.19 55.58,2.99 v55.58,3.15
N$120
  Bottom 0.152: U$7.C17 63.78,35.15 64.11,35.15 64.11,2.99 X1.20
N$121
  Bottom 0.152: U$7.C16 65.05,35.15 64.72,35.15 64.72,2.99 X2.19
N$122  (via drill 0.5)
  Top 0.152: U$7.C12 69.29,36.14 69.29,22.05 71.42,22.05 71.42,3.15 v73.25,3.15
  Bottom 0.152: X2.20 73.25,2.99 v73.25,3.15
N$127
  Top 0.406: R6.2 14.4,60.3 U$9.2 14.4,63.5 4.4,63.5 U$9.5

### Text on the board
tPlace: 11-23-09 | 11-23-09 | 11-23-09 | 11-23-09 | 11-23-09